# EAGLE design HIDaspx_mini2 (EAGLE 6.5.0)
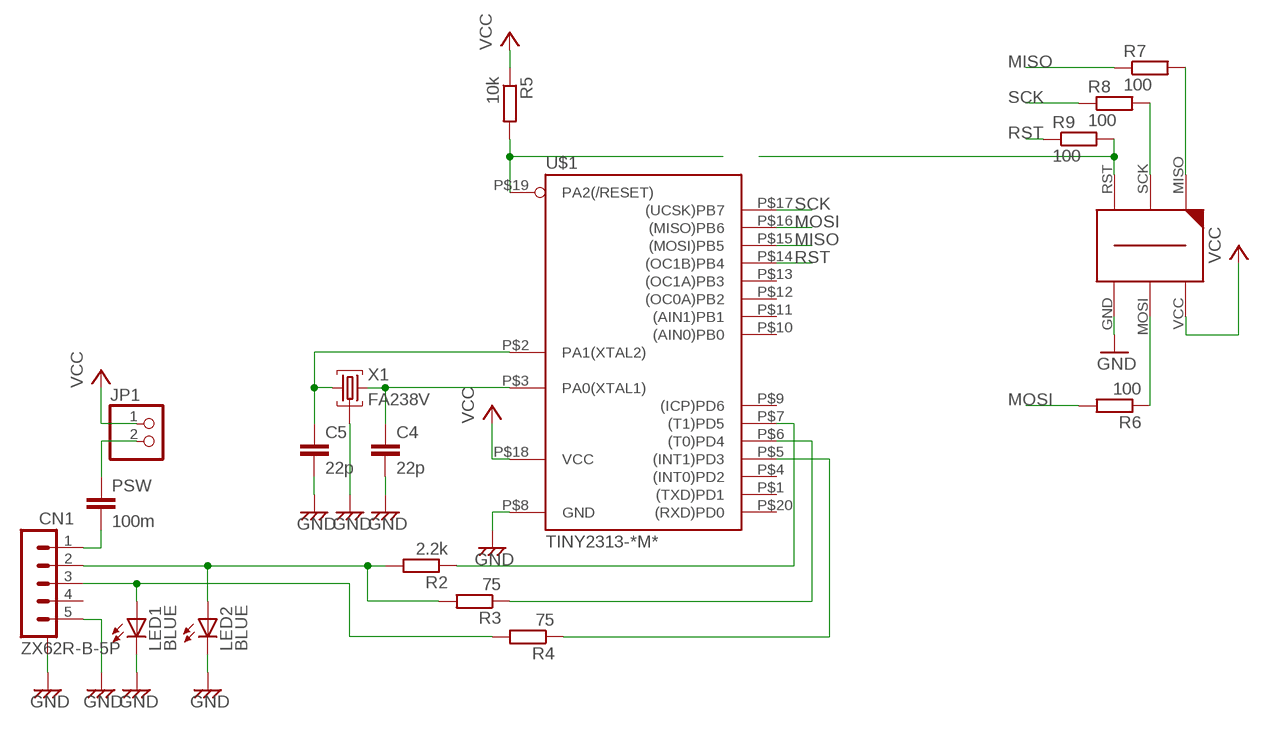
[diagram p0: schematic, sheet 1]

## Parts
C4  22p  C-EUC0603  [C0603]
C5  22p  C-EUC0603  [C0603]
CN1  ZX62R-B-5P  [MICRO-B]
JP1  PINHD-1X2HALF  [1X02/HALF]
LED1  BLUE  LEDSML0603  [SML0603]
LED2  BLUE  LEDSML0603  [SML0603]
PSW  100m  C-EUC3225  [C3225]
R2  2.2k  R-EU_R0603  [R0603]
R3  75  R-EU_R0603  [R0603]
R4  75  R-EU_R0603  [R0603]
R5  10k  R-EU_R0603  [R0603]
R6  100  R-EU_R0603  [R0603]
R7  100  R-EU_R0603  [R0603]
R8  100  R-EU_R0603  [R0603]
R9  100  R-EU_R0603  [R0603]
U$1  TINY2313-*M*  [MLF20]
U$2  AVR-ISP-6-EDGE  [6PAD_ISP]
X1  FA238V  [V66RA]

## Nets
GND: C4.2 C5.2 CN1.5(1.VBUS) CN1.CASE@1 CN1.CASE@2 CN1.CASE@3 CN1.CASE@4 LED1.C LED2.C U$1.P$8(GND) U$2.GND X1.P2GND(GND) X1.P4GND(GND)
MISO: R7.1 U$1.P$15((MOSI)PB5)
MOSI: R6.2 U$1.P$16((MISO)PB6)
N$1: C5.1 U$1.P$2(PA1(XTAL2)) X1.P1X1(X1)
N$2: JP1.2 PSW.1
N$4: C4.1 U$1.P$3(PA0(XTAL1)) X1.P3X2(X2)
N$5: CN1.1(5.GND) PSW.2
N$6: CN1.2(4.ID) LED2.A R2.2 R3.2
N$7: CN1.3(3.D+) LED1.A R4.2
N$8: R2.1 U$1.P$7((T1)PD5)
N$9: R3.1 U$1.P$6((T0)PD4)
N$10: R4.1 U$1.P$5((INT1)PD3)
N$11: R5.2 U$1.P$19(PA2(/RESET))
N$14: R8.2 U$2.SCK
N$15: R7.2 U$2.MISO
N$16: R9.2 U$2.RST
N$17: R6.1 U$2.MOSI
RST: R9.1 U$1.P$14((OC1B)PB4)
SCK: R8.1 U$1.P$17((UCSK)PB7)
VCC: JP1.1 R5.1 U$1.P$18(VCC) U$2.VCC
Unconnected: CN1.4(2.D-) U$1.P$1((TXD)PD1) U$1.P$4((INT0)PD2) U$1.P$9((ICP)PD6) U$1.P$10((AIN0)PB0) U$1.P$11((AIN1)PB1) U$1.P$12((OC0A)PB2) U$1.P$13((OC1A)PB3) U$1.P$20((RXD)PD0)

## Library data of the parts
C4 C5 PSW = rcl:C-EU: CAPACITOR, European symbol
CN1 = con-USB:ZX62R-B-5P
JP1 = pinhead':PINHD-1X2: PIN HEADER
LED1 LED2 = led:LED: LED OSRAM: - CHIPLED LG R971, LG N971, LY N971, LG Q971, LY Q971, LO R971, LY R971 LH N974, LH R974 LS Q976, LO Q976, LY Q976 LO Q996 - Hyper CHIPLED LW Q18S LB Q993, LB Q99A, LB R99A - SideLED LS A670, LO A670, LY A670, LG A670, LP A670 LB A673, LV A673, LT A673, LW A673 LH A674 LY A675 LS A676, LA A676, LO A676, LY A676, LW A676 LS A679, LY A679, LG A679 - Hyper Micro SIDELED® LS Y876, LA Y876, LO Y876, LY Y876 LT Y87S - SmartLED LW L88C, LW L88S LB L89C, LB L89S, LG L890 LS L89K, LO L89K, LY L89K LS L896, LA L896, LO L896, LY L896 - TOPLED LS T670, LO T670, LY T670, LG T670, LP T670 LSG T670, LSP T670, LSY T670, LOP T670, LYG T670 LG T671, LOG T671, LSG T671 LB T673, LV T673, LT T673, LW T673 LH T674 LS T676, LA T676, LO T676, LY T676, LB T676, LH T676, LSB T676, LW T676 LB T67C, LV T67C, LT T67C, LS T67K, LO T67K, LY T67K, LW E67C LS E67B, LA E67B, LO E67B, LY E67B, LB E67C, LV E67C, LT E67C LW T67C LS T679, LY T679, LG T679 LS T770, LO T770, LY T770, LG T770, LP T770 LB T773, LV T773, LT T773, LW T773 LH T774 LS E675, LA E675, LY E675, LS T675 LS T776, LA T776, LO T776, LY T776, LB T776 LHGB T686 LT T68C, LB T68C - Hyper Mini TOPLED® LB M676 - Mini TOPLED Santana® LG M470 LS M47K, LO M47K, LY M47K Source: http://www.osram.convergy.de LUXEON: - LUMILED® LXK2-PW12-R00, LXK2-PW12-S00, LXK2-PW14-U00, LXK2-PW14-V00 LXK2-PM12-R00, LXK2-PM12-S00, LXK2-PM14-U00 LXK2-PE12-Q00, LXK2-PE12-R00, LXK2-PE12-S00, LXK2-PE14-T00, LXK2-PE14-U00 LXK2-PB12-K00, LXK2-PB12-L00, LXK2-PB12-M00, LXK2-PB14-N00, LXK2-PB14-P00, LXK2-PB14-Q00 LXK2-PR12-L00, LXK2-PR12-M00, LXK2-PR14-Q00, LXK2-PR14-R00 LXK2-PD12-Q00, LXK2-PD12-R00, LXK2-PD12-S00 LXK2-PH12-R00, LXK2-PH12-S00 LXK2-PL12-P00, LXK2-PL12-Q00, LXK2-PL12-R00 Source: www.luxeon.com KINGBRIGHT: KA-3528ASYC Source: www.kingbright.com
R2-R9 = rcl:R-EU_: RESISTOR, European symbol
U$1 = avr-7:TINY2313*: Atmel Tiny2313 2K Flash, 128 bytes EEPROM, 128 bytes RAM
U$2 = avr-7:AVR-ISP-6-EDGE: 6 pin edge connector for ISP with ATMEL MCUs. Developed by Craig Moates (craig at moates dot net). Library by David Blundell (blundar at gmail dot com). Often, even a 6 pin header is really inconvenient for board layout and/or production. This SMD-only header is our de-facto standard for using an edge connector for programming with the help of a 6pin/10pin to edge card adapter.
X1 = crystal_epson:FA238V: EPSON TOYOCOM CRYSTAL V66RA package FA238V

## Board
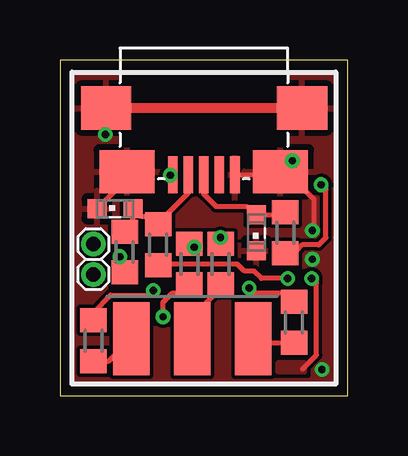
[diagram p1: board, top side]
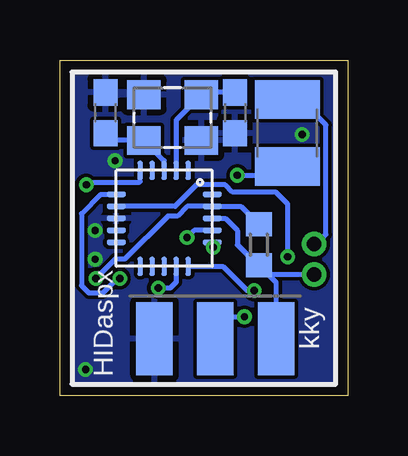
[diagram p2: board, bottom side, seen from below]

Size 12 x 13.99 mm. Coordinates in mm from the lower left corner, seen from the top.
Outline: 0,13.99 0,0 12,0 12,13.99 0,13.99
Copper layers (1*16): Top 0.035mm / dielectric 1.6mm / Bottom 0.035mm
Design rules "Elecrow_2-layer_PCB_eagle_rule": minimum track width 6mil, minimum drill 12mil, track to track 6mil, track to pad 6mil, pad to pad 6mil, via to via 8mil, smd to smd 0mil, copper to edge 20mil, drill to drill 10mil, minimum pad ring 6mil, minimum via ring 6mil, stop-mask expansion 0mil, vias tented up to drill 100mil, thermal gap 10mil

### Footprints (pad centres in the part's own frame; a part is rotated, then mirrored left to right if it is on the bottom)
C0603 = smd 1.1 x 1: 1 -0.85,0; 2 0.85,0
MICRO-B = smd 0.4 x 1.55: 1 1.3,2.775; 2 0.65,2.775; 3 0,2.775; 4 -0.65,2.775; 5 -1.3,2.775 | smd 2.3 x 1.8: CASE@1 -3.2,2.65; CASE@2 3.2,2.65 | smd 2.1 x 1.8: CASE@3 -4.1,0; CASE@4 4.075,0
1X02/HALF = drill 0.6 pad 1.016: 1 -0.635,0; 2 0.635,0
SML0603 = smd 0.8 x 0.8: A 0.75,0; C -0.75,0
C3225 = smd 1.6 x 2.7: 1 -1.4,0; 2 1.4,0
R0603 = smd 1 x 1.1: 1 -0.85,0; 2 0.85,0
MLF20 = smd 0.8 x 0.23: P$1 -2,1; P$2 -2,0.5; P$3 -2,0; P$4 -2,-0.5; P$5 -2,-1; P$11 2,-1; P$12 2,-0.5; P$13 2,0; P$14 2,0.5; P$15 2,1 | smd 0.23 x 0.8: P$6 -1,-2; P$7 -0.5,-2; P$8 0,-2; P$9 0.5,-2; P$10 1,-2; P$16 1,2; P$17 0.5,2; P$18 0,2; P$19 -0.5,2; P$20 -1,2
6PAD_ISP = smd 1.524 x 3.048 bottom: GND 2.54,0; MOSI 0,0; VCC -2.54,0 | smd 1.524 x 3.048: MISO -2.54,0; RST 2.54,0; SCK 0,0
V66RA = smd 1.4 x 1.2: P1X1 -1.2,-0.95; P2GND 1.2,-0.95; P3X2 1.2,0.95; P4GND -1.2,0.95

### Placement (x,y rotation side)
C4  10.1,11.79 90 bottom
C5  4.7,11.79 270 bottom
CN1  6,11.99 180 top
JP1  1.4,5.69 90 top
LED1  8.2,6.79 90 top
LED2  2.3,7.79 0 top
PSW  2.52,10.95 270 bottom
R2  2.7,5.99 90 top
R3  4.1,6.29 90 top
R4  9.4,6.79 90 top
R5  3.7,6.29 90 bottom
R6  5.4,5.49 90 top
R7  1.4,2.29 270 top
R8  6.7,5.49 270 top
R9  9.76,3.05 270 top
U$1  7.65,7.39 270 bottom
U$2  5.52,2.38 0 top
X1  7.3,11.59 180 bottom

### Tracks (layer width: path | path; a pad name or v marks a point on that pad's centre or on a via)
GND  (via drill 0.3)
  Top 0.2: CN1.5 9.07,9.21 | 9.07,9.21 CN1.CASE@1 9.65,9.79 v9.7,9.79 | CN1.CASE@2 2.8,9.04 LED2.C | 9.07,9.21 9.57,9.21 10.6,8.19 10.6,6.99 v10.53,6.89
  Top 0.406: CN1.CASE@3 CN1.CASE@4
  Bottom 0.2: U$2.GND 8.06,2.33 8,2.39
  other vias: 1.9,10.89 10.53,5.69 10.93,1.09
  pour Bottom: 0.5,13.49 11.5,13.49 11.5,0.49 0.5,0.49
  pour Top (rank 6): 0.5,13.49 11.5,13.49 11.5,0.49 0.5,0.49
MISO  (via drill 0.3)
  Top 0.2: 1.4,3.19 R7.1 1.4,3.49 2.1,4.19 3.7,4.19 v3.9,4.39
  Bottom 0.2: U$1.P$15 5.2,5.39 4.2,4.39 v3.9,4.39
MOSI  (via drill 0.3)
  Top 0.2: v5.6,6.19 5.4,6.19 R6.2
  Bottom 0.2: U$1.P$16 5.7,6.34 v5.6,6.19
N$1
  Bottom 0.2: C5.1 6,12.64 X1.P1X1 7.15,11.48 U$1.P$2
N$2
  Bottom 0.2: PSW.1 2.26,12.09 1.7,12.09 0.9,11.29 0.9,6.72 1.3,6.32 JP1.2
N$4
  Bottom 0.2: U$1.P$3 7.65,9.79 X1.P3X2 9.8,10.64 C4.1
N$5  (via drill 0.3)
  Top 0.2: CN1.1 4.62,9.21 v4.6,9.19
  Bottom 0.2: 2.94,9.55 PSW.2 3.04,9.55 3.4,9.19 v4.6,9.19
N$6
  Top 0.2: 3.9,6.74 R3.2 | R2.2 3.05,7.29 LED2.A 3.25,7.59 3.3,7.59 3.4,7.49 3.6,7.49 3.95,7.14 R3.2 | CN1.2 5.35,8.44 4.05,7.14 R3.2
N$7
  Top 0.2: CN1.3 6,8.39 6.5,7.89 7.8,7.89 8.05,7.64 LED1.A 9.4,7.54 R4.2 9.45,7.54
N$8  (via drill 0.3)
  Top 0.2: v2.5,5.79 2.5,5.44 R2.1
  Bottom 0.2: v2.5,5.79 2.5,7.99 3,8.49 4.8,8.49 5.1,8.79 6.3,8.79 7.2,7.89 U$1.P$7
N$9  (via drill 0.3)
  Top 0.2: 4.45,5.19 R3.1 4.25,5.14 4.6,5.49 7.4,5.49 7.7,5.19 8.1,5.19 8.4,4.89 v9.5,4.89
  Bottom 0.2: U$1.P$6 10.3,8.39 11.1,7.59 11.1,4.59 10.8,4.29 10.2,4.29 9.6,4.89 v9.5,4.89
N$10  (via drill 0.3)
  Top 0.2: v10.9,8.79 11.1,8.59 11.1,6.59 10.8,6.29 10.1,6.29 9.8,5.99 R4.1
  Bottom 0.2: U$1.P$5 8.65,8.93 8.7,8.89 10.8,8.89 v10.9,8.79
N$11  (via drill 0.3)
  Top 0.2: 10.13,1.11 10.7,1.69 10.7,4.69 v10.5,4.89
  Bottom 0.2: v10.5,4.89 9.7,5.69 9.3,5.69 7.5,7.49 7.1,7.49 6.7,7.89 U$1.P$19 4.45,7.89 R5.2
  pour Top: 9.1,0.99 9.1,1.39 10.2,1.39 10.2,0.99
N$14
  Top 0.2: 5.2,2.69 U$2.SCK 5.5,3.09 5.56,3.09 5.9,3.44 5.9,3.69 6.85,4.64 R8.2
N$15
  Top 0.2: R7.2 2.04,1.44 U$2.MISO
N$16
  Top 0.2: U$2.RST 8.23,2.2 R9.2
N$17  (via drill 0.3)
  Top 0.2: 5.1,4.64 R6.1 5.05,4.29 4.7,4.29 4.3,3.89 v4.3,3.29
  Bottom 0.2: U$2.MOSI 5.52,3.29 v4.3,3.29
RST  (via drill 0.3)
  Top 0.2: v7.9,4.49 8.1,4.29 9.3,4.29 9.5,4.09 9.78,4.09 R9.1
  Bottom 0.2: U$1.P$14 7.15,4.73 7.4,4.49 v7.9,4.49
SCK  (via drill 0.3)
  Top 0.2: v6.7,6.59 R8.1 6.7,6.24
  Bottom 0.2: U$1.P$17 6.4,6.89 v6.7,6.59
VCC
  Bottom 0.2: U$1.P$18 5.1,7.39 4.6,6.89 4.6,6.29 4.1,5.79 4.05,5.79 R5.1 3.31,5.05 | 3.31,5.05 JP1.1 | U$2.VCC 2.98,4.72 3.31,5.05

### Text on the board
bPlace: kky | HIDaspx